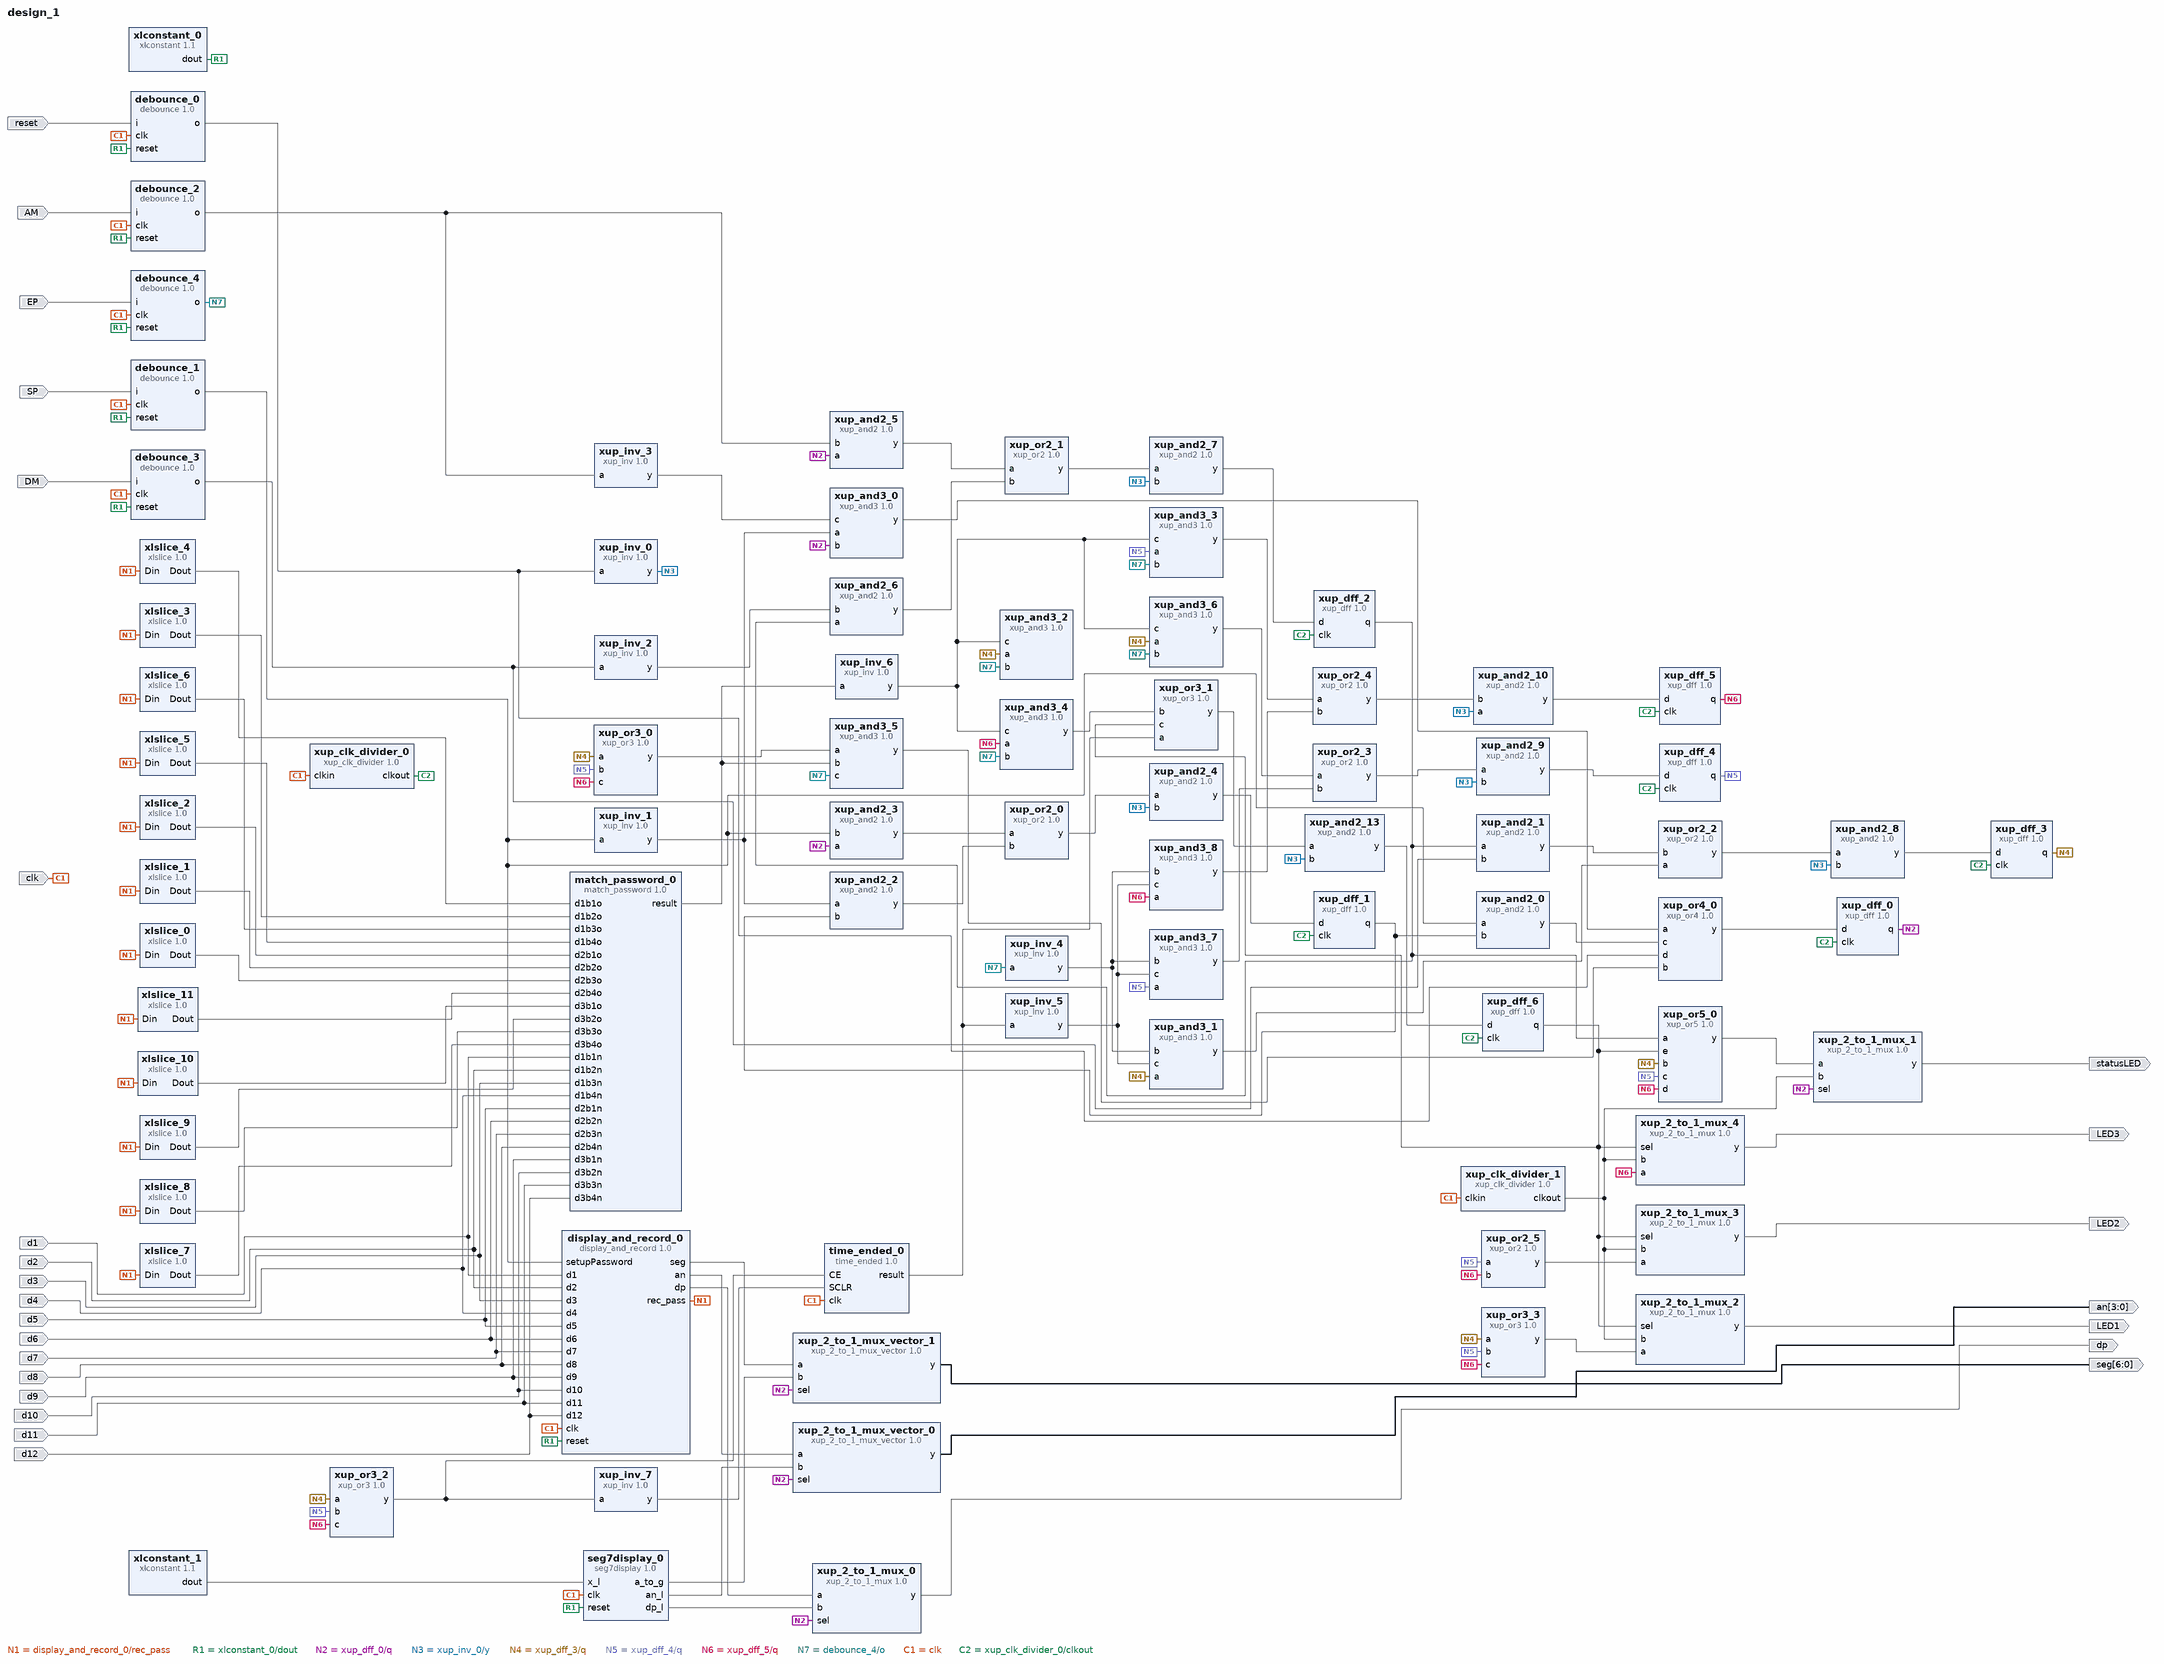
[diagram p0: block diagram of the top level]
# Vivado block design design_1, xc7a35tcpg236-1, Vivado 2018.2
create_bd_design design_1

create_bd_port -dir I d1
create_bd_port -dir I d2
create_bd_port -dir I d3
create_bd_port -dir I d4
create_bd_port -dir I d5
create_bd_port -dir I d6
create_bd_port -dir I d7
create_bd_port -dir I d8
create_bd_port -dir I d9
create_bd_port -dir I d10
create_bd_port -dir I d11
create_bd_port -dir I d12
create_bd_port -dir I SP
create_bd_port -dir I reset
create_bd_port -dir I AM
create_bd_port -dir I DM
create_bd_port -dir O -from 3 -to 0 an
create_bd_port -dir O -from 6 -to 0 seg
create_bd_port -dir O dp
create_bd_port -dir I EP
create_bd_port -dir I -type clk clk
create_bd_port -dir O statusLED
create_bd_port -dir O LED1
create_bd_port -dir O LED2
create_bd_port -dir O LED3

create_bd_cell -type ip -vlnv xilinx.com:user:display_and_record:1.0 display_and_record_0
create_bd_cell -type ip -vlnv xilinx.com:user:match_password:1.0 match_password_0
create_bd_cell -type ip -vlnv xilinx.com:ip:xlslice:1.0 xlslice_0
set_property -dict {CONFIG.DIN_TO 6 CONFIG.DIN_FROM 6 CONFIG.DIN_WIDTH 12 CONFIG.DOUT_WIDTH 1} [get_bd_cells xlslice_0]
create_bd_cell -type ip -vlnv xilinx.com:ip:xlslice:1.0 xlslice_1
set_property -dict {CONFIG.DIN_TO 5 CONFIG.DIN_FROM 5 CONFIG.DIN_WIDTH 12 CONFIG.DOUT_WIDTH 1} [get_bd_cells xlslice_1]
create_bd_cell -type ip -vlnv xilinx.com:ip:xlslice:1.0 xlslice_2
set_property -dict {CONFIG.DIN_TO 4 CONFIG.DIN_FROM 4 CONFIG.DIN_WIDTH 12 CONFIG.DOUT_WIDTH 1} [get_bd_cells xlslice_2]
create_bd_cell -type ip -vlnv xilinx.com:ip:xlslice:1.0 xlslice_3
set_property -dict {CONFIG.DIN_TO 1 CONFIG.DIN_FROM 1 CONFIG.DIN_WIDTH 12 CONFIG.DOUT_WIDTH 1} [get_bd_cells xlslice_3]
create_bd_cell -type ip -vlnv xilinx.com:ip:xlslice:1.0 xlslice_4
set_property -dict {CONFIG.DIN_TO 0 CONFIG.DIN_FROM 0 CONFIG.DIN_WIDTH 12} [get_bd_cells xlslice_4]
create_bd_cell -type ip -vlnv xilinx.com:ip:xlslice:1.0 xlslice_5
set_property -dict {CONFIG.DIN_TO 3 CONFIG.DIN_FROM 3 CONFIG.DIN_WIDTH 12 CONFIG.DOUT_WIDTH 1} [get_bd_cells xlslice_5]
create_bd_cell -type ip -vlnv xilinx.com:ip:xlslice:1.0 xlslice_6
set_property -dict {CONFIG.DIN_TO 2 CONFIG.DIN_FROM 2 CONFIG.DIN_WIDTH 12 CONFIG.DOUT_WIDTH 1} [get_bd_cells xlslice_6]
create_bd_cell -type ip -vlnv xilinx.com:ip:xlslice:1.0 xlslice_7
set_property -dict {CONFIG.DIN_TO 11 CONFIG.DIN_FROM 11 CONFIG.DIN_WIDTH 12 CONFIG.DOUT_WIDTH 1} [get_bd_cells xlslice_7]
create_bd_cell -type ip -vlnv xilinx.com:ip:xlslice:1.0 xlslice_8
set_property -dict {CONFIG.DIN_TO 10 CONFIG.DIN_FROM 10 CONFIG.DIN_WIDTH 12 CONFIG.DOUT_WIDTH 1} [get_bd_cells xlslice_8]
create_bd_cell -type ip -vlnv xilinx.com:ip:xlslice:1.0 xlslice_9
set_property -dict {CONFIG.DIN_TO 9 CONFIG.DIN_FROM 9 CONFIG.DIN_WIDTH 12 CONFIG.DOUT_WIDTH 1} [get_bd_cells xlslice_9]
create_bd_cell -type ip -vlnv xilinx.com:ip:xlslice:1.0 xlslice_10
set_property -dict {CONFIG.DIN_TO 8 CONFIG.DIN_FROM 8 CONFIG.DIN_WIDTH 12 CONFIG.DOUT_WIDTH 1} [get_bd_cells xlslice_10]
create_bd_cell -type ip -vlnv xilinx.com:ip:xlslice:1.0 xlslice_11
set_property -dict {CONFIG.DIN_TO 7 CONFIG.DIN_FROM 7 CONFIG.DIN_WIDTH 12 CONFIG.DOUT_WIDTH 1} [get_bd_cells xlslice_11]
create_bd_cell -type ip -vlnv xilinx.com:ip:xlconstant:1.1 xlconstant_0
set_property -dict {CONFIG.CONST_VAL 0} [get_bd_cells xlconstant_0]
create_bd_cell -type ip -vlnv xilinx.com:XUP:xup_dff:1.0 xup_dff_0
create_bd_cell -type ip -vlnv xilinx.com:XUP:xup_dff:1.0 xup_dff_1
create_bd_cell -type ip -vlnv xilinx.com:XUP:xup_and2:1.0 xup_and2_0
create_bd_cell -type ip -vlnv xilinx.com:XUP:xup_inv:1.0 xup_inv_0
create_bd_cell -type ip -vlnv xilinx.com:XUP:xup_inv:1.0 xup_inv_1
create_bd_cell -type ip -vlnv xilinx.com:XUP:xup_and2:1.0 xup_and2_2
create_bd_cell -type ip -vlnv xilinx.com:XUP:xup_or2:1.0 xup_or2_0
create_bd_cell -type ip -vlnv xilinx.com:XUP:xup_and2:1.0 xup_and2_3
create_bd_cell -type ip -vlnv xilinx.com:XUP:xup_and2:1.0 xup_and2_4
create_bd_cell -type ip -vlnv xilinx.com:XUP:debounce:1.0 debounce_0
set_property -dict {CONFIG.DEBOUNCE_TIME 0.1} [get_bd_cells debounce_0]
create_bd_cell -type ip -vlnv xilinx.com:XUP:debounce:1.0 debounce_1
set_property -dict {CONFIG.DEBOUNCE_TIME 0.1} [get_bd_cells debounce_1]
create_bd_cell -type ip -vlnv xilinx.com:XUP:xup_dff:1.0 xup_dff_2
create_bd_cell -type ip -vlnv xilinx.com:XUP:debounce:1.0 debounce_2
set_property -dict {CONFIG.DEBOUNCE_TIME 0.1} [get_bd_cells debounce_2]
create_bd_cell -type ip -vlnv xilinx.com:XUP:xup_and2:1.0 xup_and2_5
create_bd_cell -type ip -vlnv xilinx.com:XUP:xup_and2:1.0 xup_and2_6
create_bd_cell -type ip -vlnv xilinx.com:XUP:xup_or2:1.0 xup_or2_1
create_bd_cell -type ip -vlnv xilinx.com:XUP:xup_and2:1.0 xup_and2_7
create_bd_cell -type ip -vlnv xilinx.com:XUP:debounce:1.0 debounce_3
set_property -dict {CONFIG.DEBOUNCE_TIME 0.1} [get_bd_cells debounce_3]
create_bd_cell -type ip -vlnv xilinx.com:XUP:xup_inv:1.0 xup_inv_2
create_bd_cell -type ip -vlnv xilinx.com:XUP:xup_and3:1.0 xup_and3_0
create_bd_cell -type ip -vlnv xilinx.com:XUP:xup_inv:1.0 xup_inv_3
create_bd_cell -type ip -vlnv xilinx.com:XUP:seg7display:1.0 seg7display_0
create_bd_cell -type ip -vlnv xilinx.com:ip:xlconstant:1.1 xlconstant_1
set_property -dict {CONFIG.CONST_WIDTH 16 CONFIG.CONST_VAL 43981} [get_bd_cells xlconstant_1]
create_bd_cell -type ip -vlnv xilinx.com:XUP:xup_2_to_1_mux_vector:1.0 xup_2_to_1_mux_vector_0
create_bd_cell -type ip -vlnv xilinx.com:XUP:xup_2_to_1_mux_vector:1.0 xup_2_to_1_mux_vector_1
set_property -dict {CONFIG.SIZE 7} [get_bd_cells xup_2_to_1_mux_vector_1]
create_bd_cell -type ip -vlnv xilinx.com:XUP:xup_2_to_1_mux:1.0 xup_2_to_1_mux_0
create_bd_cell -type ip -vlnv xilinx.com:XUP:xup_dff:1.0 xup_dff_3
create_bd_cell -type ip -vlnv xilinx.com:XUP:debounce:1.0 debounce_4
set_property -dict {CONFIG.DEBOUNCE_TIME 0.1} [get_bd_cells debounce_4]
create_bd_cell -type ip -vlnv xilinx.com:XUP:xup_and2:1.0 xup_and2_1
create_bd_cell -type ip -vlnv xilinx.com:XUP:xup_and3:1.0 xup_and3_1
create_bd_cell -type ip -vlnv xilinx.com:XUP:xup_or2:1.0 xup_or2_2
create_bd_cell -type ip -vlnv xilinx.com:XUP:xup_and2:1.0 xup_and2_8
create_bd_cell -type ip -vlnv xilinx.com:XUP:xup_inv:1.0 xup_inv_4
create_bd_cell -type ip -vlnv xilinx.com:XUP:xup_inv:1.0 xup_inv_5
create_bd_cell -type ip -vlnv xilinx.com:XUP:xup_dff:1.0 xup_dff_4
create_bd_cell -type ip -vlnv xilinx.com:XUP:xup_and3:1.0 xup_and3_2
create_bd_cell -type ip -vlnv xilinx.com:XUP:xup_inv:1.0 xup_inv_6
create_bd_cell -type ip -vlnv xilinx.com:XUP:xup_dff:1.0 xup_dff_5
create_bd_cell -type ip -vlnv xilinx.com:XUP:xup_dff:1.0 xup_dff_6
create_bd_cell -type ip -vlnv xilinx.com:XUP:xup_or3:1.0 xup_or3_0
create_bd_cell -type ip -vlnv xilinx.com:XUP:xup_and3:1.0 xup_and3_5
create_bd_cell -type ip -vlnv xilinx.com:XUP:xup_or4:1.0 xup_or4_0
create_bd_cell -type ip -vlnv xilinx.com:XUP:xup_and2:1.0 xup_and2_13
create_bd_cell -type ip -vlnv xilinx.com:XUP:xup_and2:1.0 xup_and2_9
create_bd_cell -type ip -vlnv xilinx.com:XUP:xup_or2:1.0 xup_or2_3
create_bd_cell -type ip -vlnv xilinx.com:XUP:xup_and3:1.0 xup_and3_6
create_bd_cell -type ip -vlnv xilinx.com:XUP:xup_and3:1.0 xup_and3_7
create_bd_cell -type ip -vlnv xilinx.com:XUP:xup_and2:1.0 xup_and2_10
create_bd_cell -type ip -vlnv xilinx.com:XUP:xup_or2:1.0 xup_or2_4
create_bd_cell -type ip -vlnv xilinx.com:XUP:xup_and3:1.0 xup_and3_3
create_bd_cell -type ip -vlnv xilinx.com:XUP:xup_and3:1.0 xup_and3_8
create_bd_cell -type ip -vlnv xilinx.com:XUP:xup_clk_divider:1.0 xup_clk_divider_0
set_property -dict {CONFIG.SIZE 10000000} [get_bd_cells xup_clk_divider_0]
create_bd_cell -type ip -vlnv xilinx.com:user:time_ended:1.0 time_ended_0
create_bd_cell -type ip -vlnv xilinx.com:XUP:xup_or3:1.0 xup_or3_2
create_bd_cell -type ip -vlnv xilinx.com:XUP:xup_inv:1.0 xup_inv_7
create_bd_cell -type ip -vlnv xilinx.com:XUP:xup_and3:1.0 xup_and3_4
create_bd_cell -type ip -vlnv xilinx.com:XUP:xup_or3:1.0 xup_or3_1
create_bd_cell -type ip -vlnv xilinx.com:XUP:xup_2_to_1_mux:1.0 xup_2_to_1_mux_1
create_bd_cell -type ip -vlnv xilinx.com:XUP:xup_clk_divider:1.0 xup_clk_divider_1
set_property -dict {CONFIG.SIZE 50000000} [get_bd_cells xup_clk_divider_1]
create_bd_cell -type ip -vlnv xilinx.com:XUP:xup_or5:1.0 xup_or5_0
create_bd_cell -type ip -vlnv xilinx.com:XUP:xup_2_to_1_mux:1.0 xup_2_to_1_mux_2
create_bd_cell -type ip -vlnv xilinx.com:XUP:xup_or3:1.0 xup_or3_3
create_bd_cell -type ip -vlnv xilinx.com:XUP:xup_2_to_1_mux:1.0 xup_2_to_1_mux_3
create_bd_cell -type ip -vlnv xilinx.com:XUP:xup_or2:1.0 xup_or2_5
create_bd_cell -type ip -vlnv xilinx.com:XUP:xup_2_to_1_mux:1.0 xup_2_to_1_mux_4

# ---- connections ----

connect_bd_net -net d1_1 [get_bd_ports d1] [get_bd_pins display_and_record_0/d1] [get_bd_pins match_password_0/d1b1n]
connect_bd_net -net d2_1 [get_bd_ports d2] [get_bd_pins display_and_record_0/d2] [get_bd_pins match_password_0/d1b2n]
connect_bd_net -net d3_1 [get_bd_ports d3] [get_bd_pins display_and_record_0/d3] [get_bd_pins match_password_0/d1b3n]
connect_bd_net -net d4_1 [get_bd_ports d4] [get_bd_pins display_and_record_0/d4] [get_bd_pins match_password_0/d1b4n]
connect_bd_net -net d5_1 [get_bd_ports d5] [get_bd_pins display_and_record_0/d5] [get_bd_pins match_password_0/d2b1n]
connect_bd_net -net d6_1 [get_bd_ports d6] [get_bd_pins display_and_record_0/d6] [get_bd_pins match_password_0/d2b2n]
connect_bd_net -net d7_1 [get_bd_ports d7] [get_bd_pins display_and_record_0/d7] [get_bd_pins match_password_0/d2b3n]
connect_bd_net -net d8_1 [get_bd_ports d8] [get_bd_pins display_and_record_0/d8] [get_bd_pins match_password_0/d2b4n]
connect_bd_net -net d9_1 [get_bd_ports d9] [get_bd_pins display_and_record_0/d9] [get_bd_pins match_password_0/d3b1n]
connect_bd_net -net d10_1 [get_bd_ports d10] [get_bd_pins display_and_record_0/d10] [get_bd_pins match_password_0/d3b2n]
connect_bd_net -net d11_1 [get_bd_ports d11] [get_bd_pins display_and_record_0/d11] [get_bd_pins match_password_0/d3b3n]
connect_bd_net -net d12_1 [get_bd_ports d12] [get_bd_pins display_and_record_0/d12] [get_bd_pins match_password_0/d3b4n]
connect_bd_net [get_bd_pins display_and_record_0/rec_pass] \
  [get_bd_pins xlslice_4/Din] [get_bd_pins xlslice_6/Din] [get_bd_pins xlslice_5/Din] [get_bd_pins xlslice_2/Din] \
  [get_bd_pins xlslice_1/Din] [get_bd_pins xlslice_0/Din] [get_bd_pins xlslice_11/Din] [get_bd_pins xlslice_10/Din] \
  [get_bd_pins xlslice_9/Din] [get_bd_pins xlslice_8/Din] [get_bd_pins xlslice_7/Din] [get_bd_pins xlslice_3/Din]
connect_bd_net [get_bd_pins xlslice_4/Dout] [get_bd_pins match_password_0/d1b1o]
connect_bd_net [get_bd_pins xlslice_3/Dout] [get_bd_pins match_password_0/d1b2o]
connect_bd_net [get_bd_pins xlslice_6/Dout] [get_bd_pins match_password_0/d1b3o]
connect_bd_net [get_bd_pins xlslice_5/Dout] [get_bd_pins match_password_0/d1b4o]
connect_bd_net [get_bd_pins xlslice_2/Dout] [get_bd_pins match_password_0/d2b1o]
connect_bd_net [get_bd_pins xlslice_1/Dout] [get_bd_pins match_password_0/d2b2o]
connect_bd_net [get_bd_pins xlslice_0/Dout] [get_bd_pins match_password_0/d2b3o]
connect_bd_net [get_bd_pins xlslice_11/Dout] [get_bd_pins match_password_0/d2b4o]
connect_bd_net [get_bd_pins xlslice_10/Dout] [get_bd_pins match_password_0/d3b1o]
connect_bd_net [get_bd_pins xlslice_9/Dout] [get_bd_pins match_password_0/d3b2o]
connect_bd_net [get_bd_pins xlslice_8/Dout] [get_bd_pins match_password_0/d3b3o]
connect_bd_net [get_bd_pins xlslice_7/Dout] [get_bd_pins match_password_0/d3b4o]
connect_bd_net [get_bd_pins match_password_0/result] [get_bd_pins xup_inv_6/a] [get_bd_pins xup_and3_5/b]
connect_bd_net [get_bd_pins xlconstant_0/dout] \
  [get_bd_pins display_and_record_0/reset] [get_bd_pins debounce_1/reset] [get_bd_pins debounce_0/reset] \
  [get_bd_pins debounce_2/reset] [get_bd_pins debounce_3/reset] [get_bd_pins seg7display_0/reset] \
  [get_bd_pins debounce_4/reset]
connect_bd_net [get_bd_pins xup_dff_1/q] [get_bd_pins xup_and2_0/b] [get_bd_pins xup_and2_2/b]
connect_bd_net [get_bd_pins xup_and2_0/y] [get_bd_pins xup_or4_0/c]
connect_bd_net [get_bd_pins xup_dff_0/q] \
  [get_bd_pins xup_and2_3/a] [get_bd_pins xup_and2_5/a] [get_bd_pins xup_and3_0/b] [get_bd_pins xup_2_to_1_mux_vector_0/sel] \
  [get_bd_pins xup_2_to_1_mux_vector_1/sel] [get_bd_pins xup_2_to_1_mux_0/sel] [get_bd_pins xup_2_to_1_mux_1/sel]
connect_bd_net [get_bd_pins xup_inv_1/y] [get_bd_pins xup_and2_2/a] [get_bd_pins xup_and3_0/a]
connect_bd_net [get_bd_pins xup_and2_2/y] [get_bd_pins xup_or2_0/b]
connect_bd_net [get_bd_pins xup_and2_3/y] [get_bd_pins xup_or2_0/a]
connect_bd_net [get_bd_pins xup_or2_0/y] [get_bd_pins xup_and2_4/a]
connect_bd_net [get_bd_pins xup_inv_0/y] \
  [get_bd_pins xup_and2_4/b] [get_bd_pins xup_and2_7/b] [get_bd_pins xup_and2_8/b] [get_bd_pins xup_and2_13/b] \
  [get_bd_pins xup_and2_9/b] [get_bd_pins xup_and2_10/a]
connect_bd_net [get_bd_pins xup_and2_4/y] [get_bd_pins xup_dff_1/d]
connect_bd_net [get_bd_ports SP] [get_bd_pins debounce_1/i]
connect_bd_net [get_bd_pins debounce_1/o] \
  [get_bd_pins xup_inv_1/a] [get_bd_pins display_and_record_0/setupPassword] [get_bd_pins xup_and2_0/a] \
  [get_bd_pins xup_and2_3/b]
connect_bd_net [get_bd_ports reset] [get_bd_pins debounce_0/i]
connect_bd_net [get_bd_ports AM] [get_bd_pins debounce_2/i]
connect_bd_net [get_bd_pins xup_or2_1/y] [get_bd_pins xup_and2_7/a]
connect_bd_net [get_bd_pins xup_and2_5/y] [get_bd_pins xup_or2_1/a]
connect_bd_net [get_bd_pins xup_and2_6/y] [get_bd_pins xup_or2_1/b]
connect_bd_net [get_bd_pins debounce_2/o] [get_bd_pins xup_and2_5/b] [get_bd_pins xup_inv_3/a]
connect_bd_net [get_bd_pins xup_dff_2/q] [get_bd_pins xup_and2_6/a] [get_bd_pins xup_and2_1/a] [get_bd_pins xup_or5_0/a]
connect_bd_net [get_bd_ports DM] [get_bd_pins debounce_3/i]
connect_bd_net [get_bd_pins debounce_3/o] [get_bd_pins xup_inv_2/a] [get_bd_pins xup_and2_1/b]
connect_bd_net [get_bd_pins xup_inv_2/y] [get_bd_pins xup_and2_6/b]
connect_bd_net [get_bd_pins xup_and2_7/y] [get_bd_pins xup_dff_2/d]
connect_bd_net [get_bd_pins xup_inv_3/y] [get_bd_pins xup_and3_0/c]
connect_bd_net [get_bd_pins xup_and3_0/y] [get_bd_pins xup_or4_0/a]
connect_bd_net [get_bd_pins xlconstant_1/dout] [get_bd_pins seg7display_0/x_l]
connect_bd_net [get_bd_pins seg7display_0/an_l] [get_bd_pins xup_2_to_1_mux_vector_0/b]
connect_bd_net [get_bd_pins display_and_record_0/an] [get_bd_pins xup_2_to_1_mux_vector_0/a]
connect_bd_net [get_bd_pins xup_2_to_1_mux_vector_0/y] [get_bd_ports an]
connect_bd_net [get_bd_pins display_and_record_0/seg] [get_bd_pins xup_2_to_1_mux_vector_1/a]
connect_bd_net [get_bd_pins seg7display_0/a_to_g] [get_bd_pins xup_2_to_1_mux_vector_1/b]
connect_bd_net [get_bd_pins xup_2_to_1_mux_vector_1/y] [get_bd_ports seg]
connect_bd_net [get_bd_pins display_and_record_0/dp] [get_bd_pins xup_2_to_1_mux_0/a]
connect_bd_net [get_bd_pins seg7display_0/dp_l] [get_bd_pins xup_2_to_1_mux_0/b]
connect_bd_net [get_bd_pins xup_2_to_1_mux_0/y] [get_bd_ports dp]
connect_bd_net [get_bd_ports EP] [get_bd_pins debounce_4/i]
connect_bd_net [get_bd_pins xup_and2_1/y] [get_bd_pins xup_or2_2/b]
connect_bd_net [get_bd_pins xup_and3_1/y] [get_bd_pins xup_or2_2/a]
connect_bd_net [get_bd_pins xup_or2_2/y] [get_bd_pins xup_and2_8/a]
connect_bd_net [get_bd_pins xup_and2_8/y] [get_bd_pins xup_dff_3/d]
connect_bd_net [get_bd_pins xup_dff_3/q] \
  [get_bd_pins xup_and3_1/a] [get_bd_pins xup_and3_2/a] [get_bd_pins xup_or3_0/a] [get_bd_pins xup_and3_6/a] \
  [get_bd_pins xup_or3_2/a] [get_bd_pins xup_or5_0/b] [get_bd_pins xup_or3_3/a]
connect_bd_net [get_bd_pins xup_inv_4/y] [get_bd_pins xup_and3_1/b] [get_bd_pins xup_and3_7/b] [get_bd_pins xup_and3_8/b]
connect_bd_net [get_bd_pins xup_inv_5/y] [get_bd_pins xup_and3_1/c] [get_bd_pins xup_and3_7/c] [get_bd_pins xup_and3_8/c]
connect_bd_net [get_bd_pins xup_inv_6/y] [get_bd_pins xup_and3_2/c] [get_bd_pins xup_and3_6/c] [get_bd_pins xup_and3_3/c] [get_bd_pins xup_and3_4/c]
connect_bd_net [get_bd_pins xup_dff_4/q] \
  [get_bd_pins xup_or3_0/b] [get_bd_pins xup_and3_7/a] [get_bd_pins xup_and3_3/a] [get_bd_pins xup_or3_2/b] \
  [get_bd_pins xup_or5_0/c] [get_bd_pins xup_or3_3/b] [get_bd_pins xup_or2_5/a]
connect_bd_net [get_bd_pins time_ended_0/result] [get_bd_pins xup_inv_5/a] [get_bd_pins xup_or3_1/a]
connect_bd_net [get_bd_pins xup_dff_5/q] \
  [get_bd_pins xup_or3_0/c] [get_bd_pins xup_and3_8/a] [get_bd_pins xup_or3_2/c] [get_bd_pins xup_and3_4/a] \
  [get_bd_pins xup_or5_0/d] [get_bd_pins xup_or3_3/c] [get_bd_pins xup_or2_5/b] [get_bd_pins xup_2_to_1_mux_4/a]
connect_bd_net [get_bd_pins xup_dff_6/q] \
  [get_bd_pins xup_or3_1/c] [get_bd_pins xup_or5_0/e] [get_bd_pins xup_2_to_1_mux_2/sel] [get_bd_pins xup_2_to_1_mux_3/sel] \
  [get_bd_pins xup_2_to_1_mux_4/sel]
connect_bd_net [get_bd_pins debounce_0/o] [get_bd_pins xup_inv_0/a] [get_bd_pins xup_or4_0/d]
connect_bd_net [get_bd_pins xup_or3_0/y] [get_bd_pins xup_and3_5/a]
connect_bd_net [get_bd_pins xup_and3_5/y] [get_bd_pins xup_or4_0/b]
connect_bd_net [get_bd_pins xup_or4_0/y] [get_bd_pins xup_dff_0/d]
connect_bd_net [get_bd_pins xup_and2_13/y] [get_bd_pins xup_dff_6/d]
connect_bd_net [get_bd_pins xup_or2_3/y] [get_bd_pins xup_and2_9/a]
connect_bd_net [get_bd_pins xup_and2_9/y] [get_bd_pins xup_dff_4/d]
connect_bd_net [get_bd_pins xup_and3_6/y] [get_bd_pins xup_or2_3/a]
connect_bd_net [get_bd_pins xup_and3_7/y] [get_bd_pins xup_or2_3/b]
connect_bd_net [get_bd_pins xup_or2_4/y] [get_bd_pins xup_and2_10/b]
connect_bd_net [get_bd_pins xup_and2_10/y] [get_bd_pins xup_dff_5/d]
connect_bd_net [get_bd_pins xup_and3_8/y] [get_bd_pins xup_or2_4/b]
connect_bd_net [get_bd_pins xup_and3_3/y] [get_bd_pins xup_or2_4/a]
connect_bd_net [get_bd_pins debounce_4/o] \
  [get_bd_pins xup_inv_4/a] [get_bd_pins xup_and3_2/b] [get_bd_pins xup_and3_6/b] [get_bd_pins xup_and3_3/b] \
  [get_bd_pins xup_and3_5/c] [get_bd_pins xup_and3_4/b]
connect_bd_net [get_bd_ports clk] \
  [get_bd_pins debounce_4/clk] [get_bd_pins debounce_3/clk] [get_bd_pins debounce_0/clk] [get_bd_pins debounce_1/clk] \
  [get_bd_pins debounce_2/clk] [get_bd_pins display_and_record_0/clk] [get_bd_pins seg7display_0/clk] \
  [get_bd_pins xup_clk_divider_0/clkin] [get_bd_pins time_ended_0/clk] [get_bd_pins xup_clk_divider_1/clkin]
connect_bd_net [get_bd_pins xup_clk_divider_0/clkout] \
  [get_bd_pins xup_dff_0/clk] [get_bd_pins xup_dff_1/clk] [get_bd_pins xup_dff_2/clk] [get_bd_pins xup_dff_3/clk] \
  [get_bd_pins xup_dff_5/clk] [get_bd_pins xup_dff_4/clk] [get_bd_pins xup_dff_6/clk]
connect_bd_net [get_bd_pins xup_or3_2/y] [get_bd_pins time_ended_0/CE] [get_bd_pins xup_inv_7/a]
connect_bd_net [get_bd_pins xup_inv_7/y] [get_bd_pins time_ended_0/SCLR]
connect_bd_net [get_bd_pins xup_or3_1/y] [get_bd_pins xup_and2_13/a]
connect_bd_net [get_bd_pins xup_and3_4/y] [get_bd_pins xup_or3_1/b]
connect_bd_net [get_bd_pins xup_clk_divider_1/clkout] \
  [get_bd_pins xup_2_to_1_mux_1/b] [get_bd_pins xup_2_to_1_mux_2/b] [get_bd_pins xup_2_to_1_mux_3/b] \
  [get_bd_pins xup_2_to_1_mux_4/b]
connect_bd_net [get_bd_pins xup_2_to_1_mux_1/y] [get_bd_ports statusLED]
connect_bd_net [get_bd_pins xup_or5_0/y] [get_bd_pins xup_2_to_1_mux_1/a]
connect_bd_net [get_bd_pins xup_2_to_1_mux_2/y] [get_bd_ports LED1]
connect_bd_net [get_bd_pins xup_or3_3/y] [get_bd_pins xup_2_to_1_mux_2/a]
connect_bd_net [get_bd_pins xup_2_to_1_mux_3/y] [get_bd_ports LED2]
connect_bd_net [get_bd_pins xup_or2_5/y] [get_bd_pins xup_2_to_1_mux_3/a]
connect_bd_net [get_bd_pins xup_2_to_1_mux_4/y] [get_bd_ports LED3]

validate_bd_design
save_bd_design
